# Altium schematic sheet Sheet1.SchDoc
size Letter
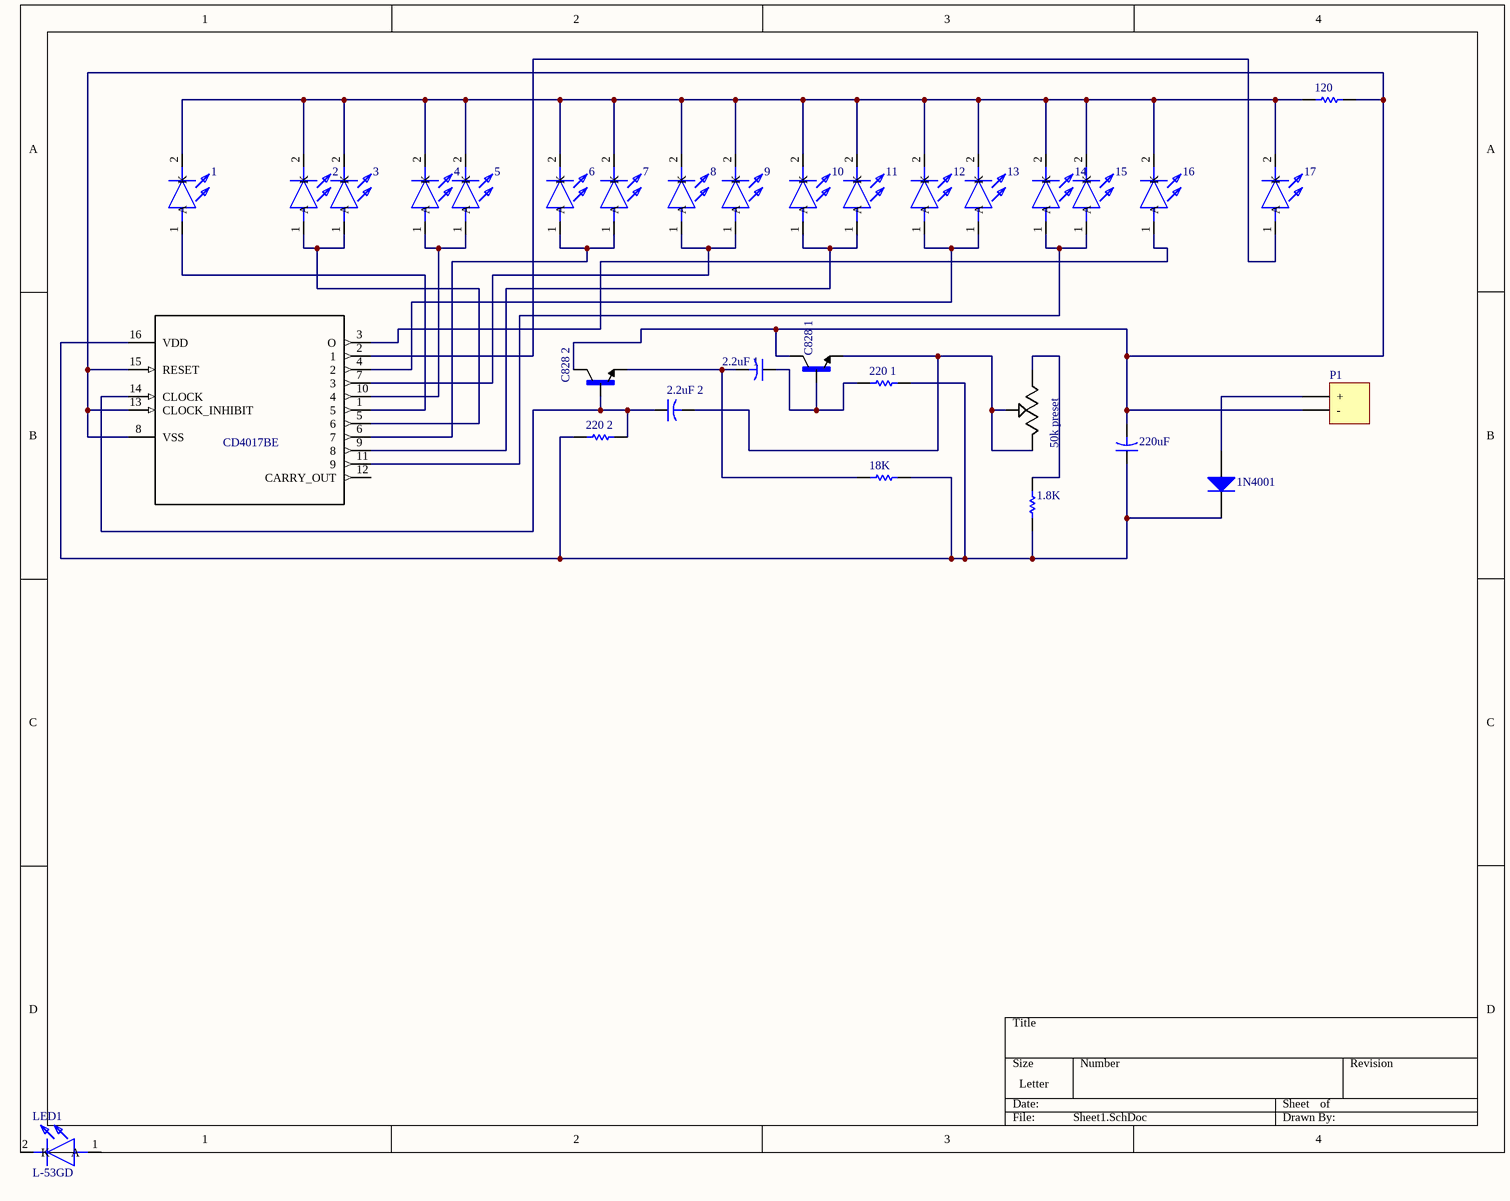
[diagram p0: Sheet1.SchDoc]

## Parts
1  L-53GD  [L-53GD]  (value not drawn)
1.8K  (no value)  [AXIAL-0.3]
1N4001  (no value)  [DO-41]
2  L-53GD  [L-53GD]  (value not drawn)
2.2uF  value 2.2uF 1  [CAPR5-4X5]
2.2uF_2  (no value)  [CAPR5-4X5]
3  L-53GD  [L-53GD]  (value not drawn)
4  L-53GD  [L-53GD]  (value not drawn)
5  L-53GD  [L-53GD]  (value not drawn)
6  L-53GD  [L-53GD]  (value not drawn)
7  L-53GD  [L-53GD]  (value not drawn)
8  L-53GD  [L-53GD]  (value not drawn)
9  L-53GD  [L-53GD]  (value not drawn)
10  L-53GD  [L-53GD]  (value not drawn)
11  L-53GD  [L-53GD]  (value not drawn)
12  L-53GD  [L-53GD]  (value not drawn)
13  L-53GD  [L-53GD]  (value not drawn)
14  L-53GD  [L-53GD]  (value not drawn)
15  L-53GD  [L-53GD]  (value not drawn)
16  L-53GD  [L-53GD]  (value not drawn)
17  L-53GD  [L-53GD]  (value not drawn)
18K  (no value)  [AXIAL-0.3]
50k_preset  50K  [*TRIM_EVN-D8AA03B14]  (value not drawn)
120  (no value)  [AXIAL-0.3]
220_1  (no value)  [AXIAL-0.3]
220_2  (no value)  [AXIAL-0.3]
220uF  (no value)  [CAPR5-4X5]
C828_1  P2N2222A  [*TO92]  (value not drawn)
C828_2  P2N2222A  [*TO92]  (value not drawn)
CD4017BE  CD4017BE  [*DIP254P762X508-16]  (value not drawn)
LED1  L-53GD  [L-53GD]
P1  (no value)  [HDR1X2]

## Nets
Net1.8K_1: 1.8K.1 50k_preset.1
Net1.8K_2: 1.8K.2 1N4001.2(K) 18K.2 220_1.2 220_2.1 220uF.1 CD4017BE.16(VDD)
Net1_1: 1.1(A) CD4017BE.1(5)
Net1_2: 1.2(K) 2.2(K) 3.2(K) 4.2(K) 5.2(K) 6.2(K) 7.2(K) 8.2(K) 9.2(K) 10.2(K) 11.2(K) 12.2(K) 13.2(K) 14.2(K) 15.2(K) 16.2(K) 17.2(K) 120.1
Net1N4001_1: 1N4001.1(A) P1.1(+)
Net2.2uF_1: 2.2uF.1 220_1.1 C828_1.2(B)
Net2.2uF_2: 2.2uF.2 18K.1 C828_2.1(E)
Net2.2uF_2_1: 2.2uF_2.1 220_2.2 C828_2.2(B) CD4017BE.14(CLOCK)
Net2.2uF_2_2: 2.2uF_2.2 50k_preset.2 50k_preset.3 C828_1.1(E)
Net2_1: 2.1(A) 3.1(A) CD4017BE.5(6)
Net4_1: 4.1(A) 5.1(A) CD4017BE.10(4)
Net6_1: 6.1(A) 7.1(A) CD4017BE.6(7)
Net8_1: 8.1(A) 9.1(A) CD4017BE.7(3)
Net10_1: 10.1(A) 11.1(A) CD4017BE.9(8)
Net12_1: 12.1(A) 13.1(A) CD4017BE.4(2)
Net14_1: 14.1(A) 15.1(A) CD4017BE.11(9)
Net16_1: 16.1(A) CD4017BE.3(O)
Net17_1: 17.1(A) CD4017BE.2(1)
Net120_2: 120.2 220uF.2 C828_1.3(C) C828_2.3(C) CD4017BE.8(VSS) CD4017BE.13(CLOCK_INHIBIT) CD4017BE.15(RESET) P1.2(-)

Not connected (* = marked no-connect by the designer): CD4017BE 12(CARRY_OUT); LED1 1(A) 2(K)

## Library data of the parts
1-17 LED1 = L-53GD: LED; Manufacturer_Name: Kingbright; Allied_Number: 70424261; Datasheet Link: http://docs-emea.rs-online.com/webdocs/151e/0900766b8151e408.pdf; Manufacturer_Part_Number: L-53GD; Mouser Part Number: N/A; Mouser Price/Stock: https://www.mouser.com/Search/Refine.aspx?Keyword=N%2FA; RS Part Number: 2286004A; RS Price/Stock: http://uk.rs-online.com/web/p/products/2286004A; Allied Price/Stock: http://www.alliedelec.com/kingbright-l-53gd/70424261/
1.8K = Res1: Resistor; Value: 1.8K; Published: 8-Jun-2000; LatestRevisionDate: 17-Jul-2002; LatestRevisionNote: Re-released for DXP Platform.; PackageReference: AXIAL-0.3; Publisher: Altium Limited; PackageDescription: Axial Device, Thru-Hole; 2 Leads; 0.3 in Pin Spacing
1N4001 = Diode 1N4001: 1 Amp General Purpose Rectifier; Published: 8-Jun-2000; LatestRevisionDate: 17-Jul-2002; LatestRevisionNote: Re-released for DXP Platform.; DatasheetVersion: 1998; PackageVersion: Aug-1999; PackageReference: DO-41; Publisher: Altium Limited; PackageDescription: Diode, Axial; Body 5.2 x 2.7 mm (LxDia. max), Lead Dia. 0.86 mm (max); Code_JEDEC: DO-204-AL; ComponentLink1Description: Manufacturer Link; ComponentLink1URL: http://www.fairchildsemi.com/; ComponentLink2Description: Datasheet; ComponentLink2URL: http://www.fairchildsemi.com/ds/1N%2F1N4001.pdf
2.2uF = Cap2: Capacitor; Published: 23-Sep-2002; PackageReference: CAPR5-4X5; Publisher: Altium Limited; PackageDescription: Capacitor; 2 Leads
2.2uF_2 = Cap2: Capacitor; Value: 2.2uF; Published: 23-Sep-2002; PackageReference: CAPR5-4X5; Publisher: Altium Limited; PackageDescription: Capacitor; 2 Leads
18K = Res1: Resistor; Value: 18K; Published: 8-Jun-2000; LatestRevisionDate: 17-Jul-2002; LatestRevisionNote: Re-released for DXP Platform.; PackageReference: AXIAL-0.3; Publisher: Altium Limited; PackageDescription: Axial Device, Thru-Hole; 2 Leads; 0.3 in Pin Spacing
50k_preset = EVN-D8AA03B14: Trimmer; Carbon; Rest 10 Kilohms; PCB; 1 Turn; Pwr-Rtg 0.1 W; Linear; Top Adj; 6 mm SQ; MF: Panasonic Electronic; Availability: Unavailable; Price: None; SnapEDA_Link: https://www.snapeda.com/parts/EVN-D8AA03B14/Panasonic%20Electronic%20Components/view-part/?ref=snap; MP: EVN-D8AA03B14; Package: PQFP-44 Panasonic; Value: *
120 220_1 220_2 = Res1: Resistor; Value: 220; Published: 8-Jun-2000; LatestRevisionDate: 17-Jul-2002; LatestRevisionNote: Re-released for DXP Platform.; PackageReference: AXIAL-0.3; Publisher: Altium Limited; PackageDescription: Axial Device, Thru-Hole; 2 Leads; 0.3 in Pin Spacing
220uF = Cap2: Capacitor; Value: 100pF; Published: 23-Sep-2002; PackageReference: CAPR5-4X5; Publisher: Altium Limited; PackageDescription: Capacitor; 2 Leads
C828_1 C828_2 = P2N2222A: MF: ON Semiconductor; SnapEDA_Link: https://www.snapeda.com/parts/P2N2222A/ON%20Semiconductor/view-part/?ref=snap; Availability: Unavailable; Package: TO-92 NXP Semiconductors; Price: None; MP: P2N2222A; Value: *
CD4017BE = CD4017BE: IC Mos 4017/CD4017BE HARRIS; MF: Texas; SnapEDA_Link: https://www.snapeda.com/parts/CD4017BE/Texas%20Instruments/view-part/?ref=snap; Availability: Unavailable; Price: None; MP: CD4017BE; Package: DIP-16 Intersil; Value: *
P1 = Header 2: Header, 2-Pin; LatestRevisionDate: 17-Jul-2002; LatestRevisionNote: Re-released for DXP Platform.; Publisher: Altium Limited